# EAGLE design Callisto_Teknic_MSOx4_LSx3_v1p0 (EAGLE 9.6.2)
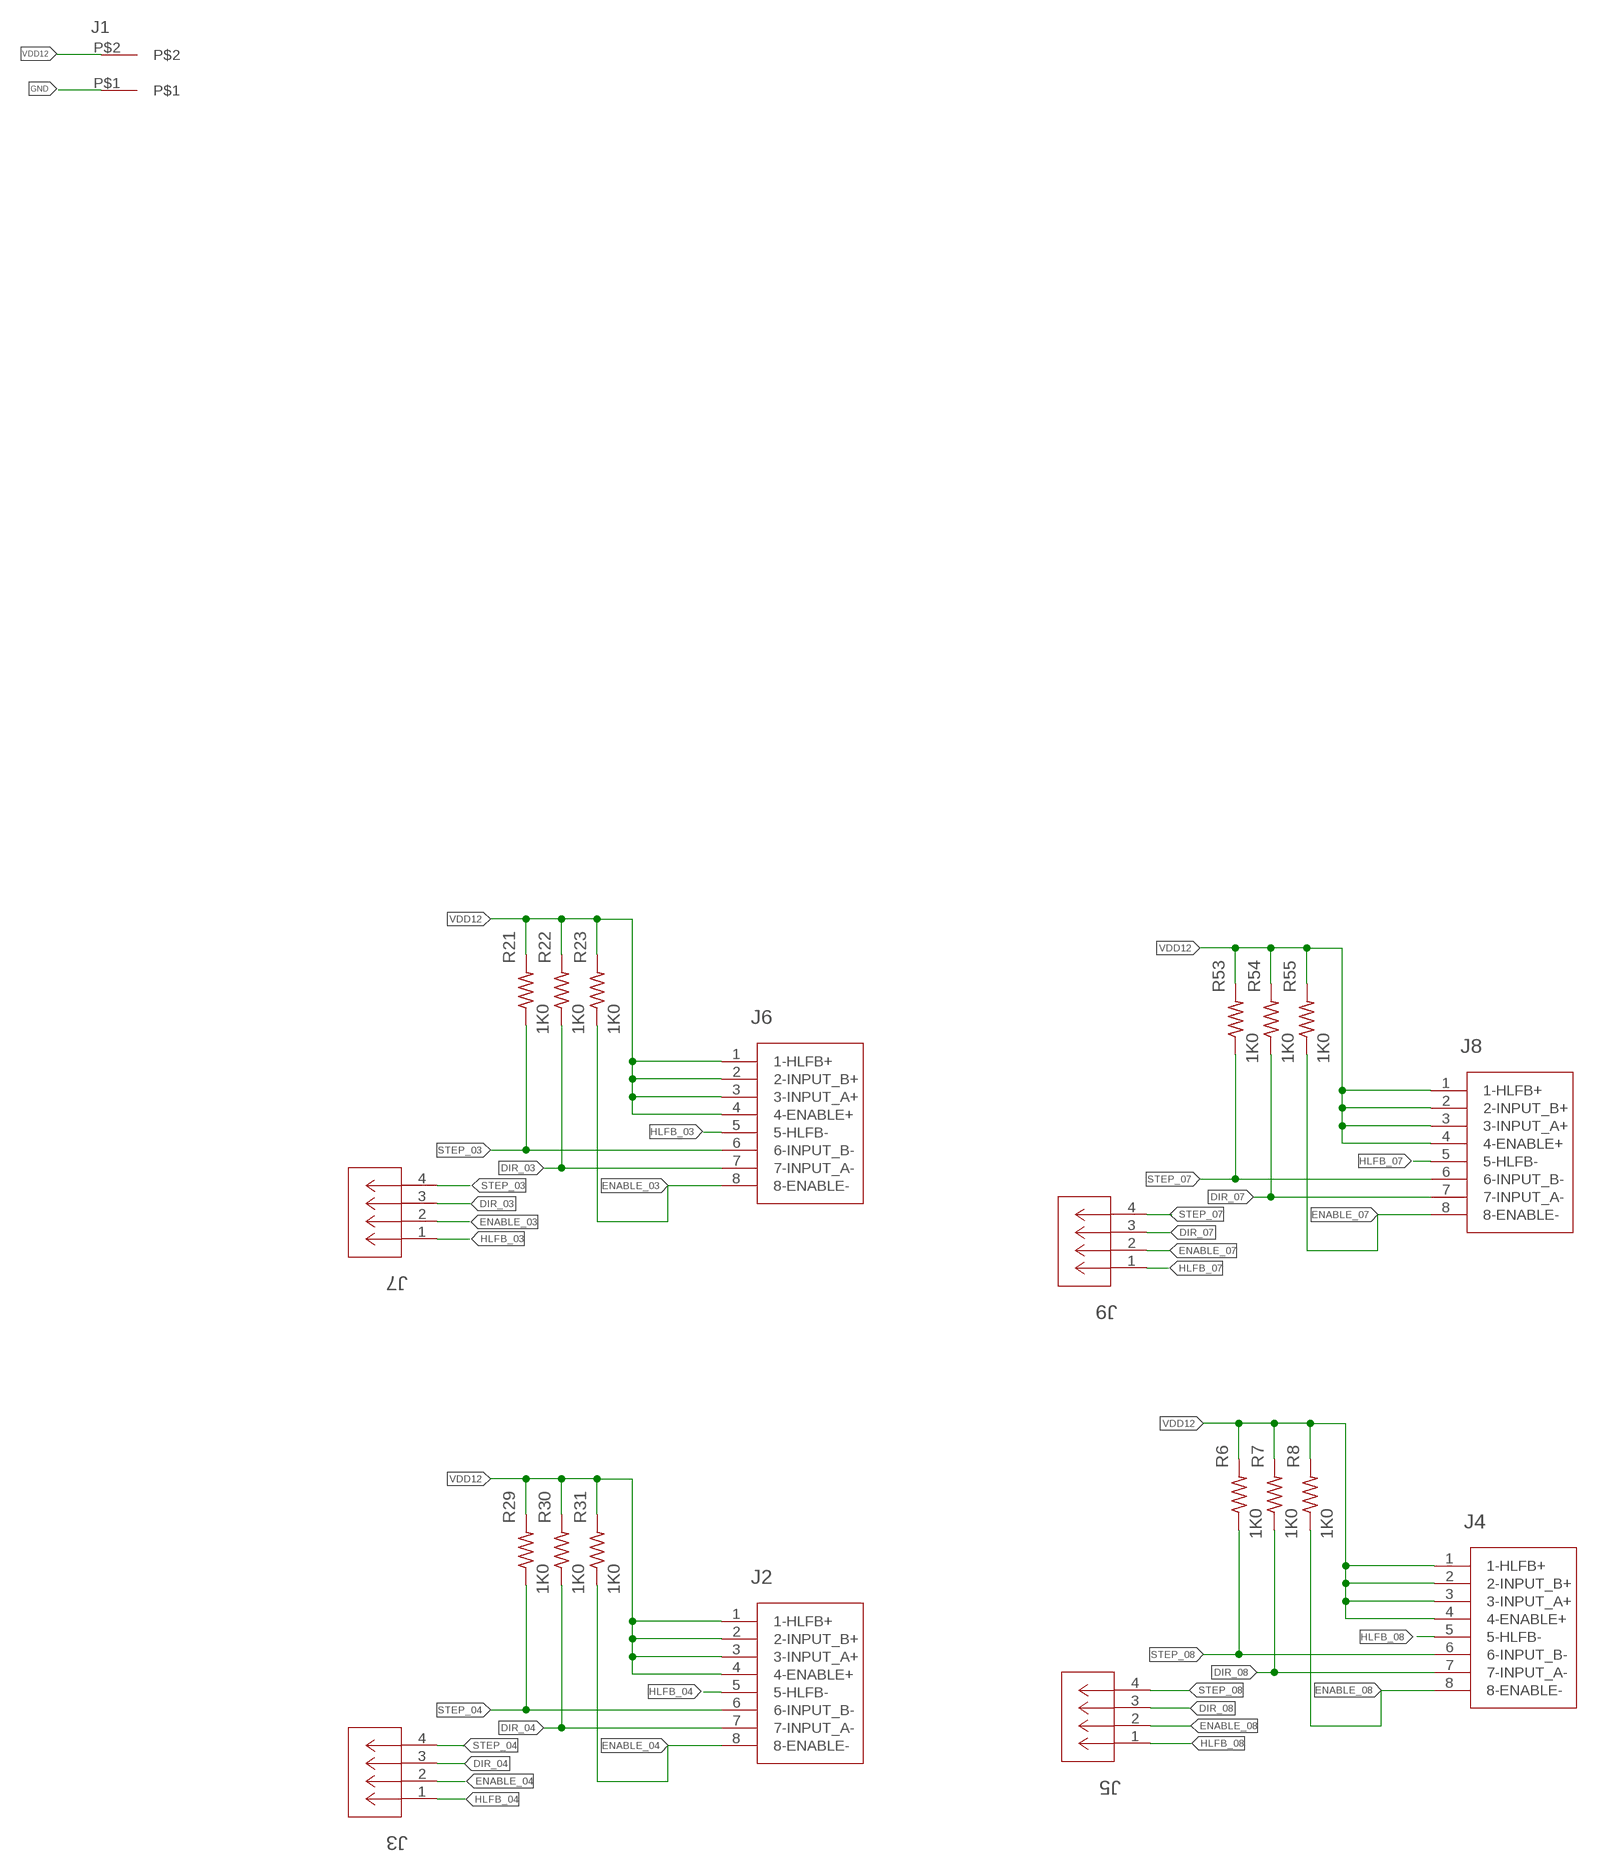
[diagram p0: schematic, sheet 1]

## Parts
J1  2-pos  3.81MM_1_X_2_RT_ANGLE_PLUG_HEADER  [2_3.81MM_PITCH]
J2  TEKNIC_8PIN_MOTOR  [CON_39281083]
J3  CONN_530470410_PICOBLADE_X_4  [CON_530470410_MOL]
J4  TEKNIC_8PIN_MOTOR  [CON_39281083]
J5  CONN_530470410_PICOBLADE_X_4  [CON_530470410_MOL]
J6  TEKNIC_8PIN_MOTOR  [CON_39281083]
J7  CONN_530470410_PICOBLADE_X_4  [CON_530470410_MOL]
J8  TEKNIC_8PIN_MOTOR  [CON_39281083]
J9  CONN_530470410_PICOBLADE_X_4  [CON_530470410_MOL]
R6  1K0  R_0402_1K0  [0402]
R7  1K0  R_0402_1K0  [0402]
R8  1K0  R_0402_1K0  [0402]
R21  1K0  R_0402_1K0  [0402]
R22  1K0  R_0402_1K0  [0402]
R23  1K0  R_0402_1K0  [0402]
R29  1K0  R_0402_1K0  [0402]
R30  1K0  R_0402_1K0  [0402]
R31  1K0  R_0402_1K0  [0402]
R53  1K0  R_0402_1K0  [0402]
R54  1K0  R_0402_1K0  [0402]
R55  1K0  R_0402_1K0  [0402]

## Nets
DIR_03: J6.7(7-INPUT_A-) J7.3 R22.1
DIR_04: J2.7(7-INPUT_A-) J3.3 R30.1
DIR_07: J8.7(7-INPUT_A-) J9.3 R54.1
DIR_08: J4.7(7-INPUT_A-) J5.3 R7.1
ENABLE_03: J6.8(8-ENABLE-) J7.2 R23.1
ENABLE_04: J2.8(8-ENABLE-) J3.2 R31.1
ENABLE_07: J8.8(8-ENABLE-) J9.2 R55.1
ENABLE_08: J4.8(8-ENABLE-) J5.2 R8.1
GND: J1.P$1
HLFB_03: J6.5(5-HLFB-) J7.1
HLFB_04: J2.5(5-HLFB-) J3.1
HLFB_07: J8.5(5-HLFB-) J9.1
HLFB_08: J4.5(5-HLFB-) J5.1
STEP_03: J6.6(6-INPUT_B-) J7.4 R21.1
STEP_04: J2.6(6-INPUT_B-) J3.4 R29.1
STEP_07: J8.6(6-INPUT_B-) J9.4 R53.1
STEP_08: J4.6(6-INPUT_B-) J5.4 R6.1
VDD12: J1.P$2 J2.1(1-HLFB+) J2.2(2-INPUT_B+) J2.3(3-INPUT_A+) J2.4(4-ENABLE+) J4.1(1-HLFB+) J4.2(2-INPUT_B+) J4.3(3-INPUT_A+) J4.4(4-ENABLE+) J6.1(1-HLFB+) J6.2(2-INPUT_B+) J6.3(3-INPUT_A+) J6.4(4-ENABLE+) J8.1(1-HLFB+) J8.2(2-INPUT_B+) J8.3(3-INPUT_A+) J8.4(4-ENABLE+) R6.2 R7.2 R8.2 R21.2 R22.2 R23.2 R29.2 R30.2 R31.2 R53.2 R54.2 R55.2

## Library data of the parts
J1 = 3D_MIG_Controller:3.81MM_1_X_2_RT_ANGLE_PLUG_HEADER: TERM BLOCK HDR 2POS 90DEG 3.81MM; PARTNO: 691322310002
J2 J4 J6 J8 = 3D_MIG_Controller:TEKNIC_8PIN_MOTOR; COPYRIGHT: Copyright (C) 2022 Ultra Librarian. All rights reserved.; MANUFACTURER_PART_NUMBER: 39281083; MFR_NAME: Molex Connector Corporation
J3 J5 J7 J9 = 3D_MIG_Controller:CONN_530470410_PICOBLADE_X_4; COPYRIGHT: Copyright (C) 2022 Ultra Librarian. All rights reserved.; MANUFACTURER_PART_NUMBER: 530470410; MFR_NAME: Molex Connector Corporation
R6-R8 R21-R23 R29-R31 R53-R55 = 3D_MIG_Controller:R_0402_1K0; PARTNO: CRG0402J1K0

## Board
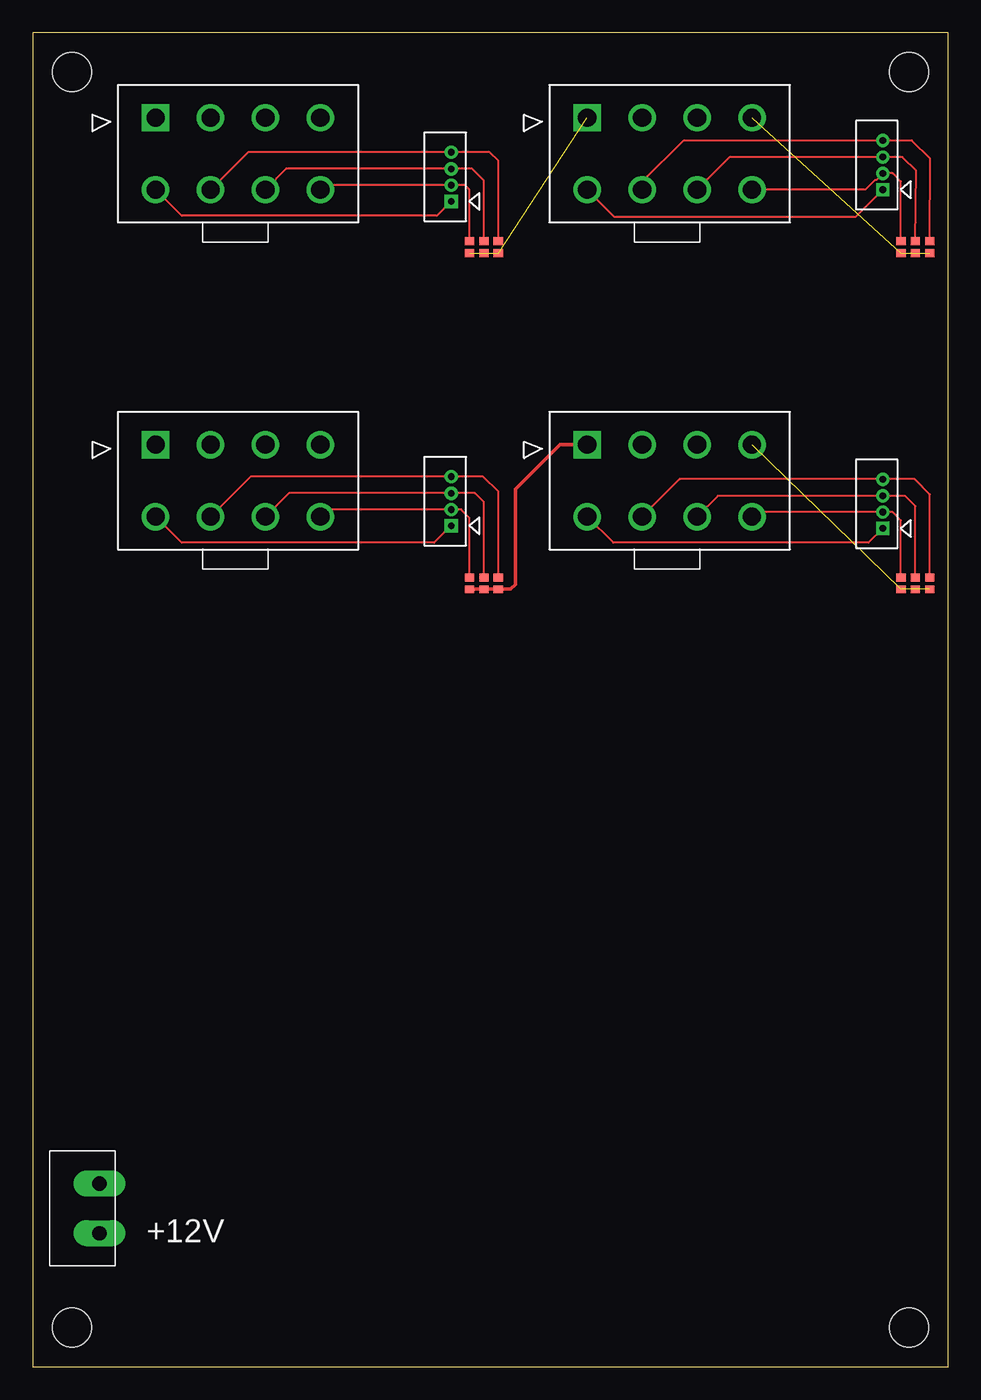
[diagram p1: board, top side]
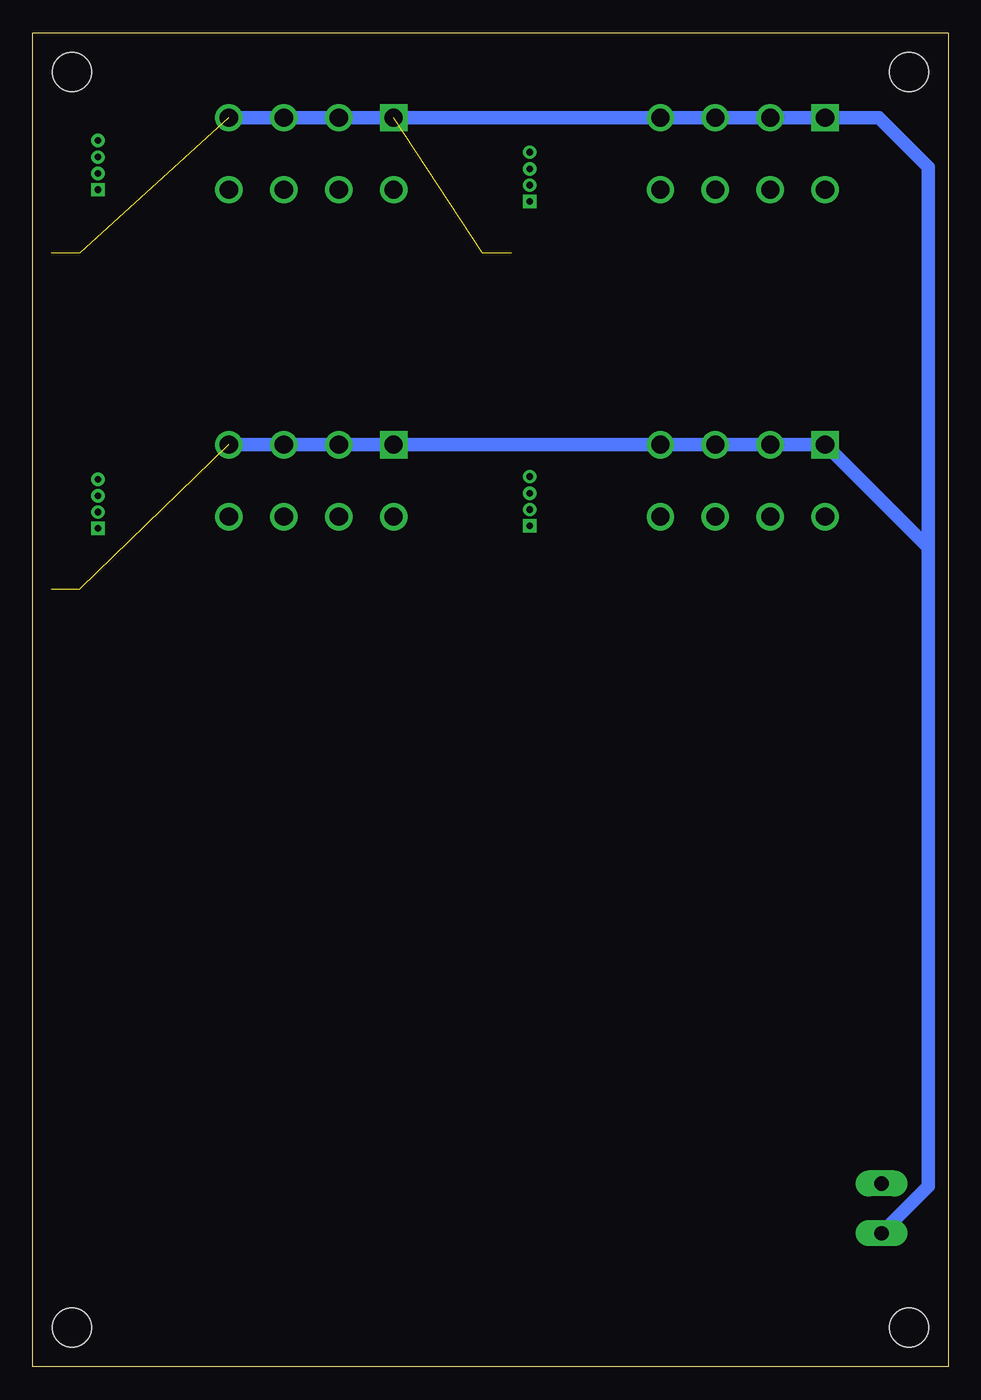
[diagram p2: board, bottom side, seen from below]

Size 70 x 102 mm. Coordinates in mm from the lower left corner, seen from the top.
Outline: 0,0 70,0 70,102 0,102 0,0
Copper layers (1*16): Top 0.035mm / dielectric 1.5mm / Bottom 0.035mm
Design rules "default": minimum track width 6mil, minimum drill 0.2mm, track to track 6mil, track to pad 6mil, pad to pad 6mil, via to via 6mil, smd to smd 6mil, copper to edge 40mil, drill to drill 6mil, minimum pad ring 10mil, minimum via ring 4mil, stop-mask expansion 4mil, vias tented up to drill 0mil, thermal gap 10mil
Holes 3 mm at 3,3 67,3 67,99 3,99

### Footprints (pad centres in the part's own frame; a part is rotated, then mirrored left to right if it is on the bottom)
2_3.81MM_PITCH = drill 1.1 pad 2 long: P$1 0,0; P$2 3.81,0
CON_39281083 = drill 1.397 pad 1.905 square: 1 12.6,-5.5 | drill 1.397 pad 1.905: 2 8.4,-5.5; 3 4.2,-5.5; 4 0,-5.5; 5 12.6,0; 6 8.4,0; 7 4.2,0; 8 0,0
CON_530470410_MOL = drill 0.508 pad 0.838 square: 1 0,0 | drill 0.508 pad 0.838: 2 -1.245,0; 3 -2.489,0; 4 -3.759,0
0402 = smd 0.7 x 0.6: 1 0,0.45; 2 0,-0.45

### Placement (x,y rotation side)
J1  5.1,14.02 270 top
J2  22,90 180 top
J3  32,89.1 270 top
J4  55,90 180 top
J5  65,90 270 top
J6  22,65 180 top
J7  32,64.3 270 top
J8  55,65 180 top
J9  65,64.1 270 top
R6  68.6,85.6 0 top
R7  67.5,85.6 0 top
R8  66.4,85.6 0 top
R21  35.6,59.9 0 top
R22  34.5,59.9 0 top
R23  33.4,59.9 0 top
R29  35.6,85.6 0 top
R30  34.5,85.6 0 top
R31  33.4,85.6 0 top
R53  68.6,59.9 0 top
R54  67.5,59.9 0 top
R55  66.4,59.9 0 top

### Tracks (layer width: path | path; a pad name or v marks a point on that pad's centre or on a via)
DIR_03
  Top 0.152: R22.1 34.5,66.1 33.81,66.79 J7.3 19.59,66.79 J6.7
DIR_04
  Top 0.152: R30.1 34.5,90.7 33.61,91.59 J3.3 19.39,91.59 J2.7
DIR_07
  Top 0.152: R54.1 67.5,65.8 66.71,66.59 J9.3 52.39,66.59 J8.7
DIR_08
  Top 0.152: R7.1 67.55,91.45 66.51,92.49 J5.3 53.29,92.49 J4.7
ENABLE_03
  Top 0.152: R23.1 33.4,64.9 32.76,65.55 J7.2 22.55,65.55 J6.8
ENABLE_04
  Top 0.152: R31.1 33.4,90 33.05,90.34 J3.2 22.34,90.34 J2.8
ENABLE_07
  Top 0.152: R55.1 66.4,64.7 65.75,65.34 J9.2 55.34,65.34 J8.8
ENABLE_08
  Top 0.152: R8.1 66.39,90.61 65.75,91.25 J5.2 64.49,90.74 64.4,90.74 63.66,90 J4.8
HLFB_03
  Top 0.152: J7.1 30.7,63 11.4,63 J6.5
HLFB_04
  Top 0.152: J3.1 30.9,88 11.4,88 J2.5
HLFB_07
  Top 0.152: J9.1 63.9,63 44.4,63 J8.5
HLFB_08
  Top 0.152: J5.1 62.9,87.9 44.5,87.9 J4.5
STEP_03
  Top 0.152: R21.1 35.6,66.9 34.44,68.06 J7.4 16.66,68.06 J6.6
STEP_04
  Top 0.152: R29.1 35.6,92.2 34.94,92.86 J3.4 16.46,92.86 J2.6
STEP_07
  Top 0.152: R53.1 68.6,66.7 67.44,67.86 J9.4 49.46,67.86 J8.6
STEP_08
  Top 0.152: R6.1 68.63,92.37 67.24,93.76 J5.4 49.76,93.76 46.6,90.6 J4.6
VDD12  (9 unrouted)
  Top 0.254: J8.1 40.3,70.5 36.9,67.1 36.9,59.8 36.55,59.45 R21.2 R22.2 R23.2
  Bottom 1.016: J1.P$2 1.52,13.79 1.52,62.62 | 1.52,62.62 J6.1 J6.2 J6.3 J6.4 J8.1 J8.2 J8.3 | J8.3 51.2,70.9 | J8.3 J8.4 | J4.4 J4.3 J4.2 J4.1 J2.4 J2.3 J2.2 J2.1 5.3,95.5 1.52,91.72 1.52,62.62

### Text on the board
tPlace: GND | +12V